# EAGLE design knobhead (EAGLE 9.6.2)
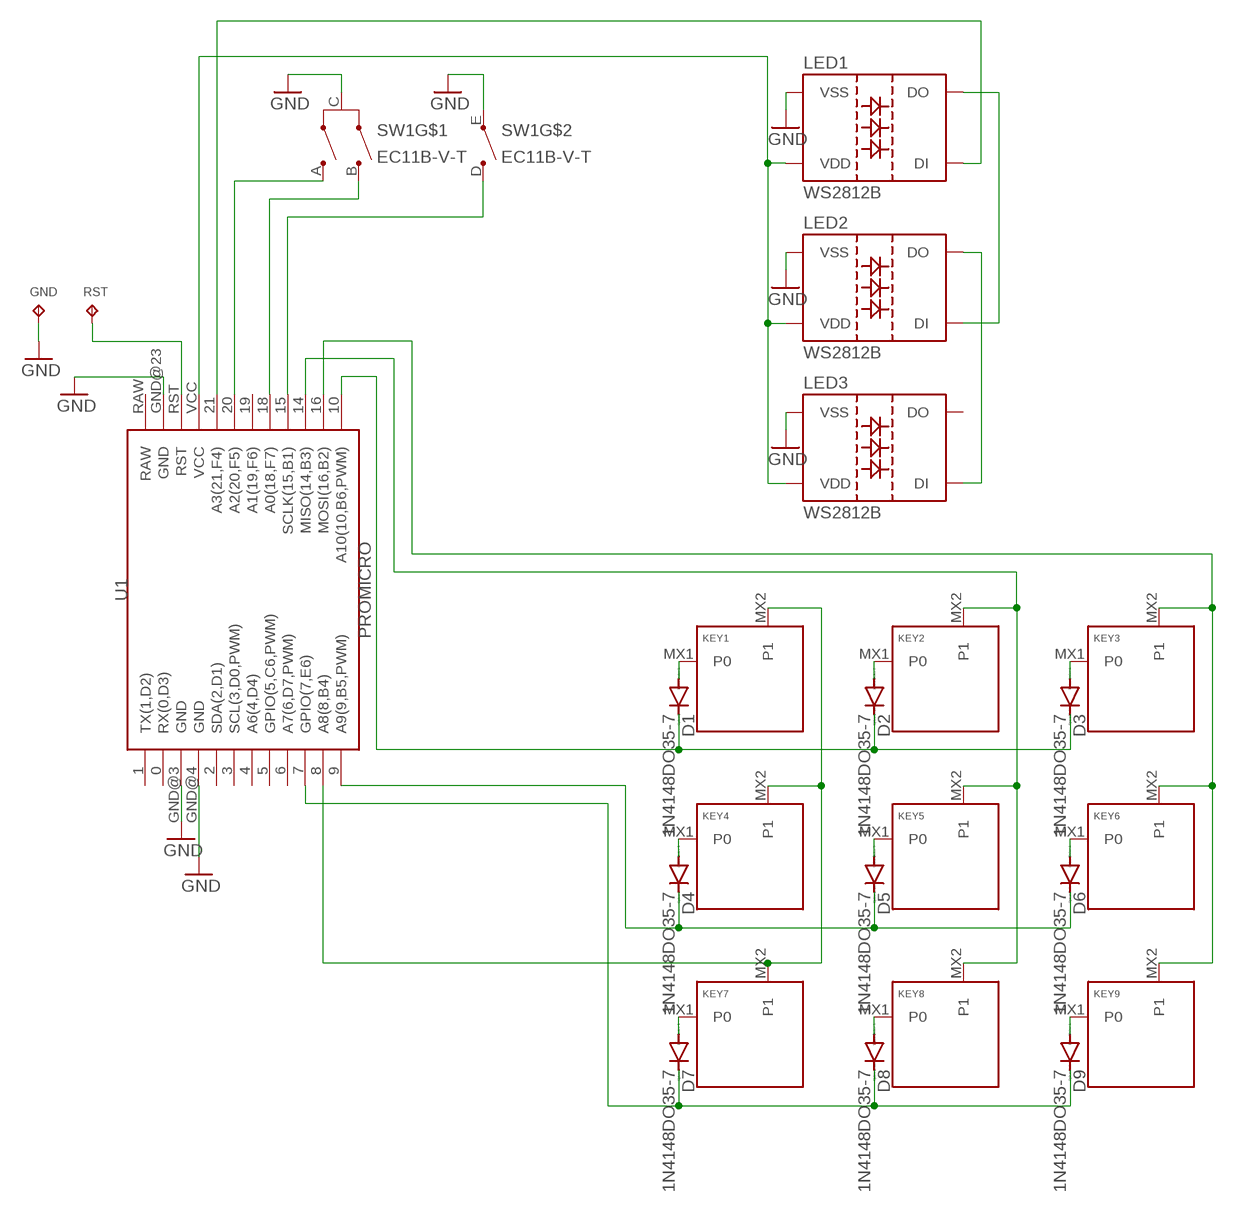
[diagram p0: schematic, sheet 1]

## Parts
D1  1N4148DO35-7  [DO35-7]
D2  1N4148DO35-7  [DO35-7]
D3  1N4148DO35-7  [DO35-7]
D4  1N4148DO35-7  [DO35-7]
D5  1N4148DO35-7  [DO35-7]
D6  1N4148DO35-7  [DO35-7]
D7  1N4148DO35-7  [DO35-7]
D8  1N4148DO35-7  [DO35-7]
D9  1N4148DO35-7  [DO35-7]
GND  TPB1,27  [B1,27]
KEY1  KEYSWITCH-PLAIN-MXHSPCB-1U  [MXHSPCB-1U]
KEY2  KEYSWITCH-PLAIN-MXHSPCB-1U  [MXHSPCB-1U]
KEY3  KEYSWITCH-PLAIN-MXHSPCB-1U  [MXHSPCB-1U]
KEY4  KEYSWITCH-PLAIN-MXHSPCB-1U  [MXHSPCB-1U]
KEY5  KEYSWITCH-PLAIN-MXHSPCB-1U  [MXHSPCB-1U]
KEY6  KEYSWITCH-PLAIN-MXHSPCB-1U  [MXHSPCB-1U]
KEY7  KEYSWITCH-PLAIN-MXHSPCB-1U  [MXHSPCB-1U]
KEY8  KEYSWITCH-PLAIN-MXHSPCB-1U  [MXHSPCB-1U]
KEY9  KEYSWITCH-PLAIN-MXHSPCB-1U  [MXHSPCB-1U]
LED1  WS2812B  [WS2812B]
LED2  WS2812B  [WS2812B]
LED3  WS2812B  [WS2812B]
RST  TPB1,27  [B1,27]
SW1  EC11B-V-T  [EC11B-V]
U1  PROMICRO  [PROMICRO]

## Nets
GND: GND.TP LED1.3(VSS) LED2.3(VSS) LED3.3(VSS) SW1.C SW1.E U1.GND@3(GND) U1.GND@4(GND) U1.GND@23(GND)
N$1: D1.A KEY1.MX1(P0)
N$2: D2.A KEY2.MX1(P0)
N$3: D3.A KEY3.MX1(P0)
N$4: D4.A KEY4.MX1(P0)
N$5: D5.A KEY5.MX1(P0)
N$6: D6.A KEY6.MX1(P0)
N$7: D7.A KEY7.MX1(P0)
N$8: D8.A KEY8.MX1(P0)
N$9: D9.A KEY9.MX1(P0)
N$10: D1.C D2.C D3.C U1.10(A10(10,B6,PWM))
N$11: D4.C D5.C D6.C U1.9(A9(9,B5,PWM))
N$12: D7.C D8.C D9.C U1.7(GPIO(7,E6))
N$13: KEY1.MX2(P1) KEY4.MX2(P1) KEY7.MX2(P1) U1.8(A8(8,B4))
N$14: KEY2.MX2(P1) KEY5.MX2(P1) KEY8.MX2(P1) U1.14(MISO(14,B3))
N$15: KEY3.MX2(P1) KEY6.MX2(P1) KEY9.MX2(P1) U1.16(MOSI(16,B2))
N$16: LED1.1(VDD) LED2.1(VDD) LED3.1(VDD) U1.VCC
N$17: LED1.4(DI) U1.21(A3(21,F4))
N$20: LED1.2(DO) LED2.4(DI)
N$21: LED2.2(DO) LED3.4(DI)
N$22: SW1.A U1.20(A2(20,F5))
N$23: SW1.B U1.18(A0(18,F7))
N$24: SW1.D U1.15(SCLK(15,B1))
N$25: RST.TP U1.RST
Unconnected: LED3.2(DO) U1.0(RX(0,D3)) U1.1(TX(1,D2)) U1.2(SDA(2,D1)) U1.3(SCL(3,D0,PWM)) U1.4(A6(4,D4)) U1.5(GPIO(5,C6,PWM)) U1.6(A7(6,D7,PWM)) U1.19(A1(19,F6)) U1.RAW

## Library data of the parts
D1-D9 = diode:1N4148: DIODE high speed (Philips)
GND RST = testpad:TP: Test pad
KEY1-KEY9 = Keyboard:KEYSWITCH-PLAIN
LED1-LED3 = WS2812:WS2812B
SW1 = alps:EC11B-V-T: ALPS EC11B Vertikal mit Taster Drehimpulsgeber 11mm
U1 = MCU:PROMICRO

## Board
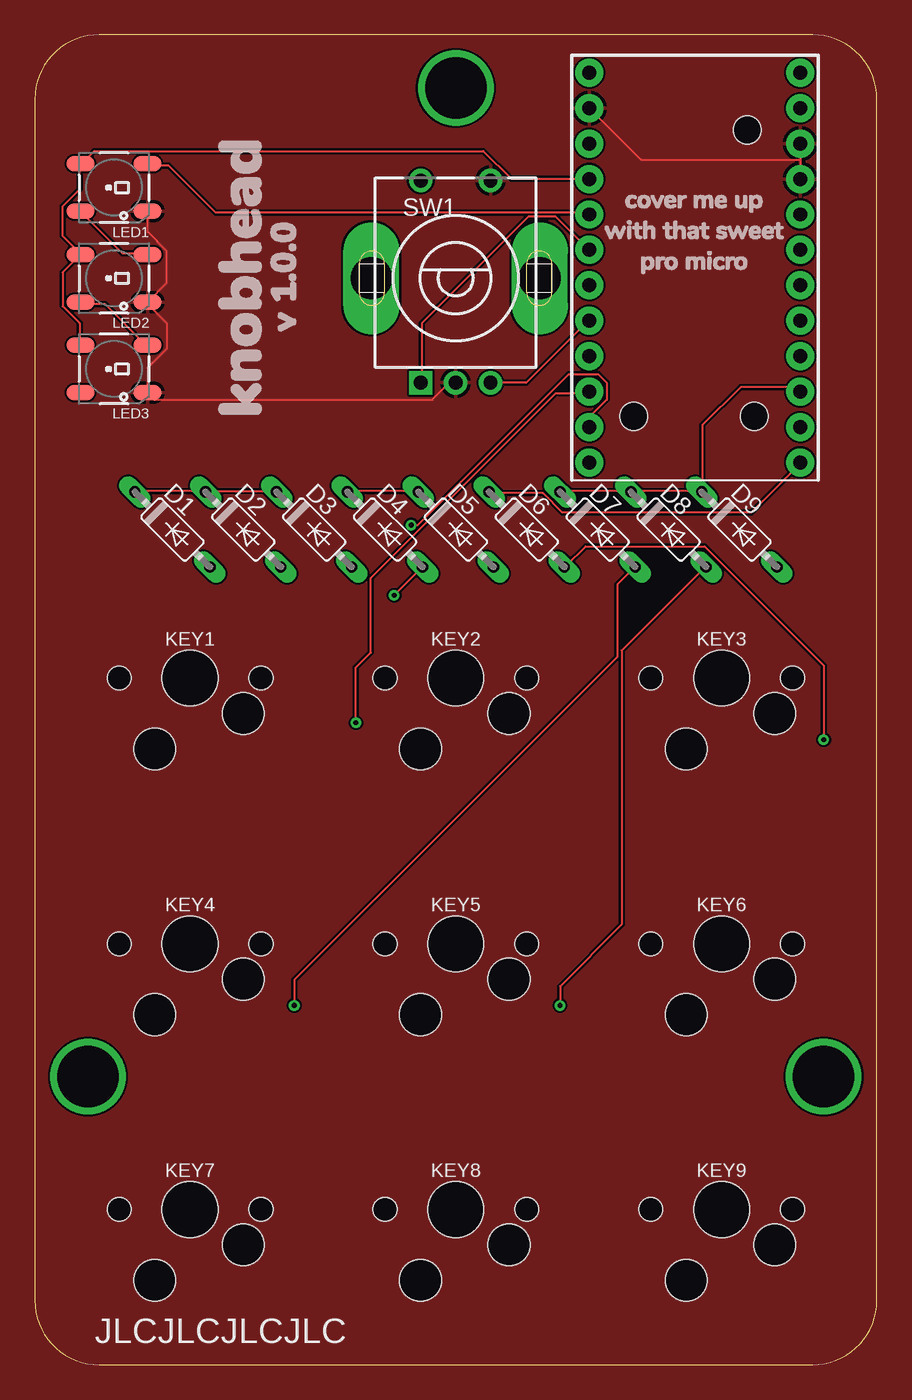
[diagram p1: board, top side]
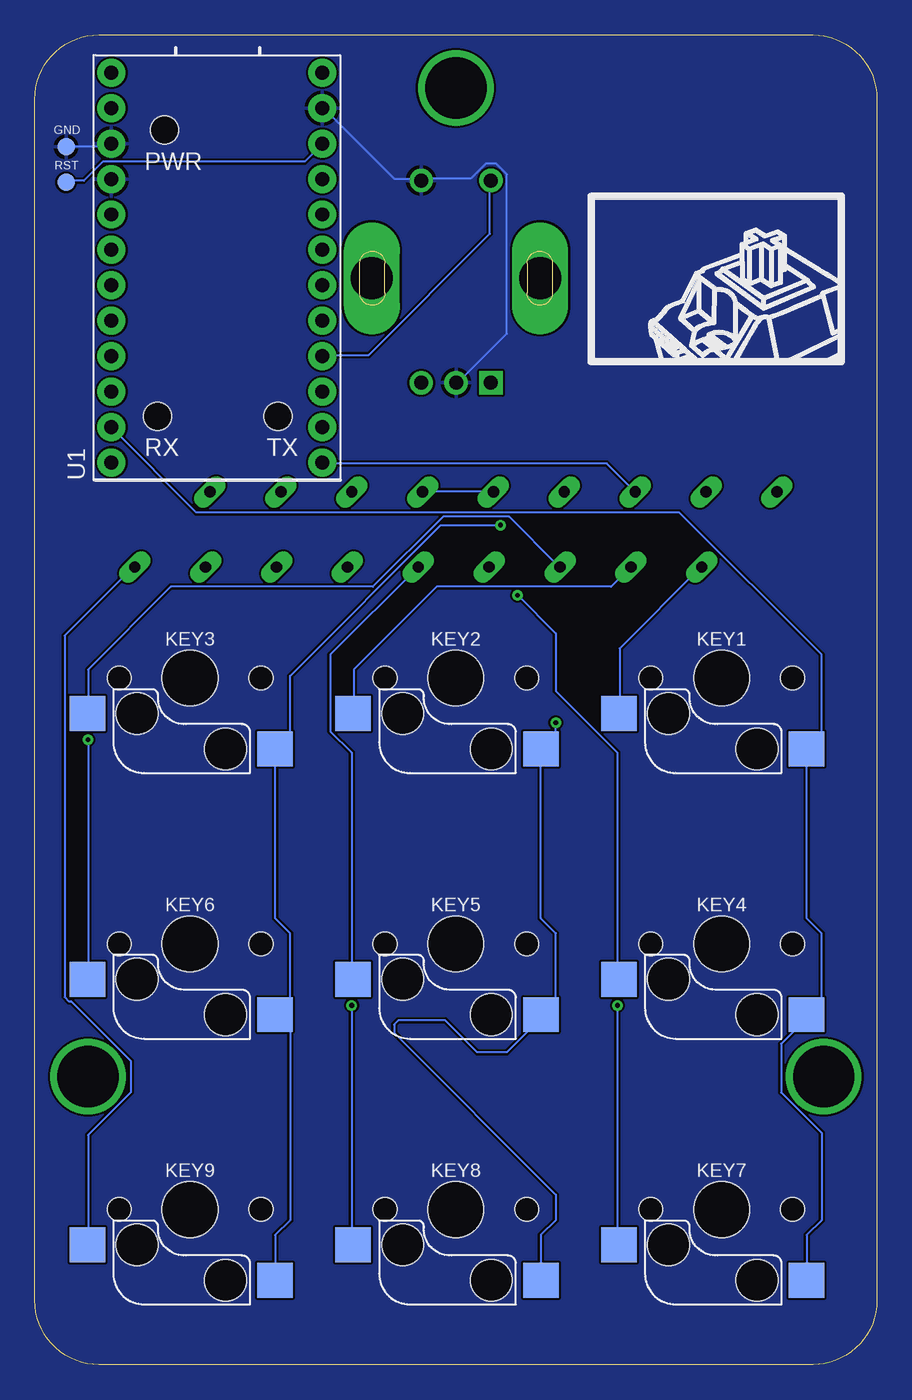
[diagram p2: board, bottom side, seen from below]

Size 60.35 x 95.35 mm. Coordinates in mm from the lower left corner, seen from the top.
Outline: 60.35,90.75 arc90 55.75,95.35 4.6,95.35 arc90 0,90.75 0,4.6 arc90 4.6,0 55.75,0 arc90 60.35,4.6 60.35,90.75
Copper layers (1*16): Top 0.035mm / dielectric 1.5mm / Bottom 0.035mm
Design rules "default *": minimum track width 6mil, minimum drill 0.35mm, track to track 6mil, track to pad 6mil, pad to pad 6mil, via to via 6mil, smd to smd 6mil, copper to edge 0mil, drill to drill 6mil, minimum pad ring 10mil, minimum via ring 8mil, stop-mask expansion 4mil, vias tented up to drill 0mil, thermal gap 10mil

### Footprints (pad centres in the part's own frame; a part is rotated, then mirrored left to right if it is on the bottom)
DO35-7 = drill 0.813 long: A 3.81,0; C -3.81,0
B1,27 = smd 1.27 x 1.27: TP 0,0
MXHSPCB-1U = smd 2.55 x 2.5: MX1 7.36,2.54; MX2 -6.09,5.08 | hole 4: 0,0 | hole 1.7: 5.08,0; -5.08,0 | hole 3: 3.81,2.54; -2.54,5.08
WS2812B = smd 2 x 1.1: 1 2.4,-1.7; 2 2.4,1.7; 3 -2.4,1.7; 4 -2.4,-1.7
EC11B-V = drill 1 pad 1.676 square: A -2.5,-7.5 | drill 1 pad 1.676: B 2.5,-7.5; C 0,-7.5; D -2.5,7; E 2.5,7 | drill 3 pad 3.3 long: G1 -6.032,0; G2 6.032,0
PROMICRO = drill 1 pad 2: 0 -7.62,11.43; 1 -7.62,13.97; 2 -7.62,3.81; 3 -7.62,1.27; 4 -7.62,-1.27; 5 -7.62,-3.81; 6 -7.62,-6.35; 7 -7.62,-8.89; 8 -7.62,-11.43; 9 -7.62,-13.97; 10 7.5,-13.97; 14 7.5,-8.89; 15 7.5,-6.35; 16 7.5,-11.43; 18 7.5,-3.81; 19 7.5,-1.27; 20 7.5,1.27; 21 7.5,3.81; GND@3 -7.62,8.89; GND@4 -7.62,6.35; GND@23 7.5,11.43; RAW 7.5,13.97; RST 7.5,8.89; VCC 7.5,6.35 | hole 2: -3.82,9.87; -4.318,-10.67; 4.318,-10.67

### Placement (x,y rotation side)
D1  9.85,59.89 315 top
D2  14.93,59.89 315 top
D3  20.01,59.89 315 top
D4  25.09,59.89 315 top
D5  30.17,59.89 315 top
D6  35.25,59.89 315 top
D7  40.33,59.89 315 top
D8  45.41,59.89 315 top
D9  50.49,59.89 315 top
GND  58.11,87.33 0 bottom
KEY1  11.12,49.23 180 bottom
KEY2  30.17,49.23 180 bottom
KEY3  49.22,49.23 180 bottom
KEY4  11.12,30.18 180 bottom
KEY5  30.17,30.18 180 bottom
KEY6  49.22,30.18 180 bottom
KEY7  11.12,11.13 180 bottom
KEY8  30.17,11.13 180 bottom
KEY9  49.22,11.13 180 bottom
LED1  5.67,84.4 180 top
LED2  5.67,77.9 180 top
LED3  5.67,71.4 180 top
RST  58.11,84.79 0 bottom
SW1  30.16,77.9 0 top
U1  47.24,78.66 0 bottom

### Tracks (layer width: path | path; a pad name or v marks a point on that pad's centre or on a via)
GND
  Top 0.152: U1.GND@3 54.86,86.41 | 54.86,86.41 U1.GND@4 | 54.86,86.41 43.43,86.41 39.78,90.07 U1.GND@23 | LED1.3 8.08,82.6 8.08,81.23 9.45,79.86 9.45,77.57 LED2.3 8.08,76.05 9.45,74.68 9.45,72.85 8.08,71.48 8.08,69.8 LED3.3 8.08,69.65 8.53,69.19 28.5,69.19 29.56,70.26 30.02,70.26 SW1.C
  Bottom 0.152: GND.TP 55.02,87.33 54.86,87.48 U1.GND@3 | U1.GND@23 39.62,90.07 34.59,85.04 32.77,85.04 SW1.E 32.61,85.04 29.11,85.04 28.04,86.11 27.28,86.11 26.52,85.34 26.52,73.91 30.02,70.41 SW1.C
  pour Top (rank 3): -9.2,102.57 73.35,102.57 73.35,-5.38 -9.2,-5.38
  pour Bottom (rank 3): -7.93,102.57 68.27,102.57 67,-6.65 -11.74,-4.11
N$1
  Bottom 0.152: KEY1.MX1 18.44,46.79 18.44,51.36 12.65,57.15 D1.A
N$2
  Bottom 0.152: KEY2.MX1 37.49,46.79 37.49,49.84 31.55,55.78 19.05,55.78 17.68,57.15 D2.A
N$3
  Bottom 0.152: KEY3.MX1 56.54,46.79 56.54,49.84 50.6,55.78 36.12,55.78 31.09,60.81 26.36,60.81 22.86,57.3 D3.A
N$4  (via drill 0.35)
  Top 0.152: v25.75,55.17 27.74,57.15 D4.A
  Bottom 0.152: v25.75,55.17 23.01,52.43 23.01,48.31 18.59,43.89 18.59,27.74 KEY4.MX1
N$5
  Bottom 0.152: KEY5.MX1 37.64,27.74 37.64,43.89 39.17,45.42 39.17,50.9 32.92,57.15 D5.A
N$6  (via drill 0.35)
  Top 0.152: v56.54,44.81 56.54,50.14 48.01,58.67 39.47,58.67 38.1,57.3 D6.A
  Bottom 0.152: v56.54,44.81 56.54,27.74 KEY6.MX1
N$7  (via drill 0.35)
  Top 0.152: v18.59,25.76 18.59,27.58 41.76,50.75 41.76,55.93 42.98,57.15 D7.A
  Bottom 0.152: v18.59,25.76 18.59,8.69 KEY7.MX1
N$8  (via drill 0.35)
  Top 0.152: v37.64,25.76 37.64,27.13 42.06,31.55 42.06,51.21 48.01,57.15 D8.A
  Bottom 0.152: v37.64,25.76 37.64,8.69 KEY8.MX1
N$9
  Bottom 0.152: KEY9.MX1 56.54,8.69 56.54,16.46 53.49,19.51 53.49,21.79 57.76,26.06 57.91,26.06 58.22,26.37 58.22,52.27 53.34,57.15 D9.A
N$10
  Top 0.152: D1.C 7.16,62.64 12.19,62.64 D2.C 12.34,62.64 17.22,62.64 D3.C
  Bottom 0.152: U1.10 39.62,64.62 19.35,64.62 17.37,62.64 D3.C
N$11
  Top 0.152: D6.C 32.61,62.48 36.42,62.48 37.79,61.11 51.36,61.11 54.86,64.62 U1.9 | D4.C 22.4,62.64 27.43,62.64 D5.C
  Bottom 0.152: D5.C 27.58,62.64 32.46,62.64 D6.C
N$12
  Top 0.152: U1.7 54.86,69.8 54.56,70.1 50.6,70.1 47.85,67.36 47.85,62.64 D9.C 47.7,62.64 42.82,62.64 D8.C 42.67,62.64 37.64,62.64 D7.C
N$13
  Bottom 0.152: KEY7.MX2 5.03,6.1 5.03,9.3 3.96,10.36 3.96,16.61 6.86,19.51 6.86,23.01 5.18,24.69 5.18,24.99 KEY4.MX2 5.03,25.15 3.96,26.21 3.96,30.94 5.03,32 5.03,44.04 KEY1.MX2 5.03,44.2 3.96,45.26 3.96,50.9 14.17,61.11 48.77,61.11 54.86,67.21 U1.8
N$14  (via drill 0.35)
  Top 0.152: v23.01,46.03 23.01,49.99 24.08,51.05 24.08,56.39 37.34,69.65 39.62,69.65 U1.14
  Bottom 0.152: KEY8.MX2 24.08,6.1 24.08,9.3 23.01,10.36 23.01,12.19 34.59,23.77 34.59,24.38 34.29,24.69 30.94,24.69 28.65,22.4 26.52,22.4 24.23,24.69 24.23,24.99 KEY5.MX2 24.08,25.15 23.01,26.21 23.01,30.94 24.08,32 24.08,44.04 KEY2.MX2 24.08,44.2 23.01,45.26 v23.01,46.03
N$15  (via drill 0.35)
  Top 0.152: v26.97,60.2 27.43,60.2 38.25,71.02 40.39,71.02 40.99,70.41 40.99,69.19 39.78,67.97 39.78,67.36 U1.16
  Bottom 0.152: KEY9.MX2 43.13,6.1 43.13,9.3 42.06,10.36 42.06,23.93 43.13,24.99 KEY6.MX2 43.13,25.15 42.06,26.21 42.06,30.94 43.13,32 43.13,44.04 KEY3.MX2 43.13,44.2 42.06,45.26 42.06,49.38 31.24,60.2 v26.97,60.2
N$16
  Top 0.152: LED3.1 3.2,73.15 3.2,74.68 1.98,75.9 1.98,78.33 3.2,79.55 LED2.1 3.2,79.71 1.98,80.92 1.98,83.06 3.2,84.28 3.2,85.95 LED1.1 3.35,86.11 4.27,87.02 32.16,87.02 34.14,85.04 39.62,85.04 U1.VCC
N$17
  Top 0.152: LED1.4 8.08,85.95 9.6,85.95 12.95,82.6 39.62,82.6 U1.21
N$18  (via drill 4.4)
  other vias: 3.81,20.65
N$19  (via drill 4.4)
  other vias: 56.54,20.65
N$20
  Top 0.152: LED2.4 7.92,79.71 6.25,79.71 3.35,82.6 LED1.2
N$21
  Top 0.152: LED2.2 3.35,76.05 5.03,76.05 7.92,73.15 LED3.4
N$22
  Top 0.152: SW1.A 27.74,70.41 27.74,74.68 35.36,82.3 37.34,82.3 39.62,80.01 U1.20
N$23
  Top 0.152: SW1.B 32.77,70.41 35.2,70.41 39.62,74.83 U1.18
N$24
  Bottom 0.152: SW1.D 27.74,84.89 27.74,81.08 36.42,72.39 39.62,72.39 U1.15
N$25
  Bottom 0.152: RST.TP 58.06,84.89 56.84,84.89 55.47,86.26 40.99,86.26 39.78,87.48 U1.RST
S$1  (via drill 4.4)
  other vias: 30.17,91.54

### Text on the board
tNames: JLCJLCJLCJLC